# Altium schematic sheet LCD.SchDoc
size A4; Revision: B.2(PCB.SCH)
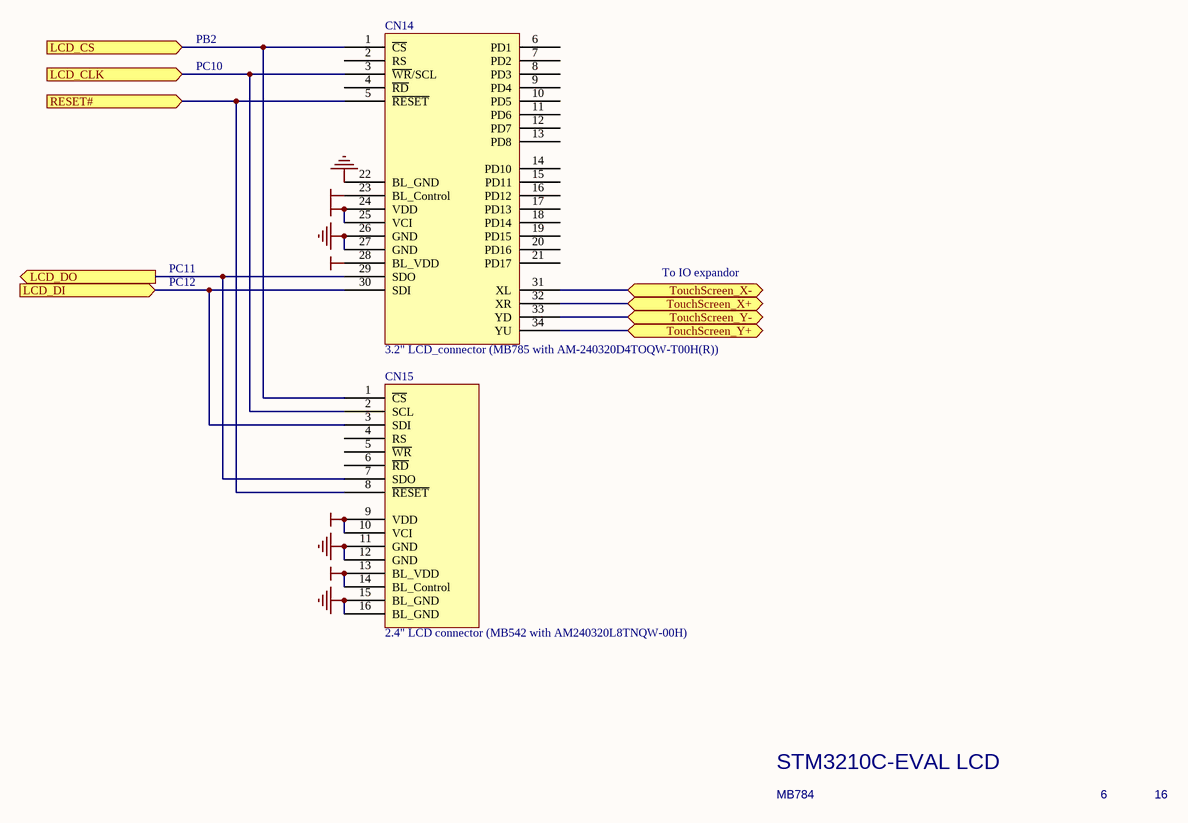
[diagram p0: LCD.SchDoc]

## Parts
CN14  3.2" LCD_connector (MB785 with AM-240320D4TOQW-T00H(R))  [AM240*320AA]
CN15  2.4" LCD connector (MB542 with AM240320L8TNQW-00H)  [AM240*320B]

## Ports
LCD_CLK (in), LCD_CS (in), LCD_DI (in), LCD_DO (out), RESET# (in), TouchScreen_X+ (bidir), TouchScreen_X- (bidir), TouchScreen_Y+ (bidir), TouchScreen_Y- (bidir)

## Nets
+3V3: CN14.24(VDD) CN14.25(VCI) CN15.9(VDD) CN15.10(VCI) CN15.13(BL_VDD) CN15.14(BL_Control)
+5V: CN14.23(BL_Control) CN14.28(BL_VDD)
GND: CN14.22(BL_GND) CN14.26(GND) CN14.27(GND) CN15.11(GND) CN15.12(GND) CN15.15(BL_GND) CN15.16(BL_GND)
LCD_CLK: CN14.3(~{WR}/SCL) CN15.2(SCL) ; port LCD_CLK
LCD_CS: CN14.1(~{CS}) CN15.1(~{CS}) ; port LCD_CS
LCD_DI: CN14.30(SDI) CN15.3(SDI) ; port LCD_DI
LCD_DO: CN14.29(SDO) CN15.7(SDO) ; port LCD_DO
RESET#: CN14.5(~{RESET}) CN15.8(~{RESET}) ; port RESET#
TouchScreen_X+: CN14.32(XR) ; port TouchScreen_X+
TouchScreen_X-: CN14.31(XL) ; port TouchScreen_X-
TouchScreen_Y+: CN14.34(YU) ; port TouchScreen_Y+
TouchScreen_Y-: CN14.33(YD) ; port TouchScreen_Y-

Not connected (* = marked no-connect by the designer): CN14 2(RS) 4(~{RD}) 6(PD1) 7(PD2) 8(PD3) 9(PD4) 10(PD5) 11(PD6) 12(PD7) 13(PD8) 14(PD10) 15(PD11) 16(PD12) 17(PD13) 18(PD14) 19(PD15) 20(PD16) 21(PD17); CN15 4(RS) 5(~{WR}) 6(~{RD})

## Notes on the sheet
- PB2
- PC10
- PC11
- PC12
- To IO expandor
- STM3210C-EVAL LCD
- MB784
- 6
- 16
- STMicroelectronics
- Title:
- Number:
- Rev:
- Date:
- Sheet       of

## Library data of the parts
CN14 = 3.2LCD_connector
CN15 = ColorLCD_module